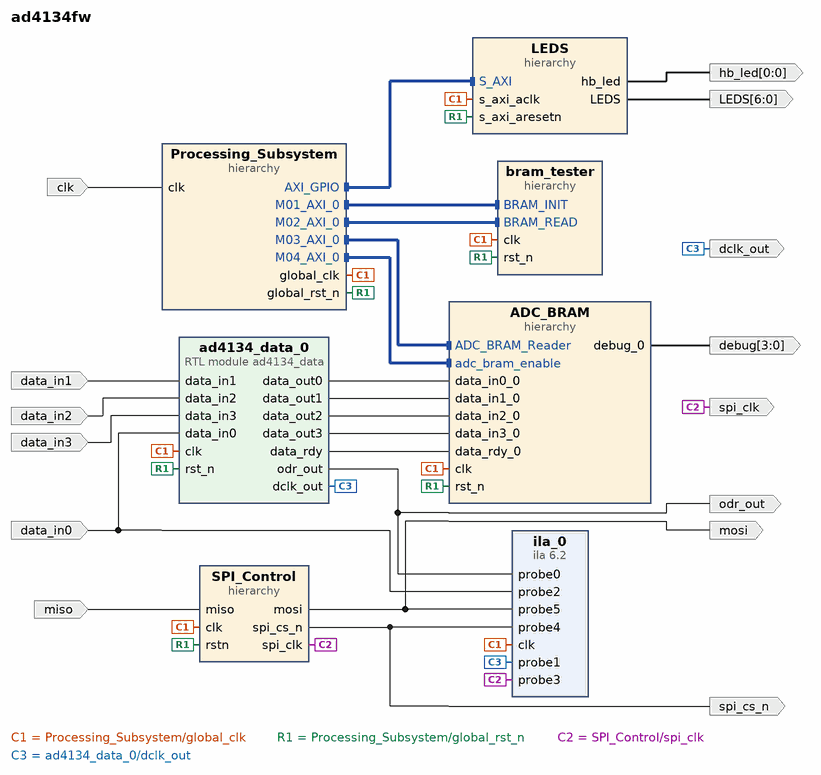
[diagram p0: block diagram of the top level]
# Vivado block design ad4134fw, xck26-sfvc784-2LV-c, Vivado 2024.2
create_bd_design ad4134fw

create_bd_port -dir O spi_clk
create_bd_port -dir I miso
create_bd_port -dir O mosi
create_bd_port -dir O spi_cs_n
create_bd_port -dir O -from 3 -to 0 debug
create_bd_port -dir O -from 6 -to 0 LEDS
create_bd_port -dir O -from 0 -to 0 hb_led
create_bd_port -dir O dclk_out
create_bd_port -dir O odr_out
create_bd_port -dir I data_in0
create_bd_port -dir I data_in1
create_bd_port -dir I data_in2
create_bd_port -dir I data_in3
create_bd_port -dir I -type clk clk
set_property -dict {CONFIG.FREQ_HZ 25000000} [get_bd_ports clk]

create_bd_cell -type hier Processing_Subsystem
create_bd_cell -type hier SPI_Control
create_bd_cell -type hier LEDS
create_bd_cell -type module -reference ad4134_data ad4134_data_0
create_bd_cell -type hier bram_tester
create_bd_cell -type hier ADC_BRAM
create_bd_cell -type ip -vlnv xilinx.com:ip:ila:6.2 ila_0
set_property -dict [list \
  CONFIG.C_ADV_TRIGGER true \
  CONFIG.C_DATA_DEPTH 131072 \
  CONFIG.C_EN_STRG_QUAL 1 \
  CONFIG.C_MONITOR_TYPE Native \
  CONFIG.C_NUM_OF_PROBES 6 \
] [get_bd_cells ila_0]

# ---- hierarchy /Processing_Subsystem ----
current_bd_instance /Processing_Subsystem
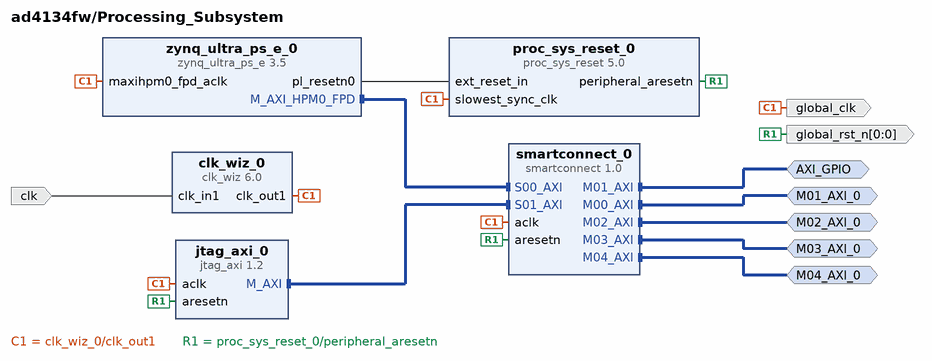
[diagram p1: block diagram inside /Processing_Subsystem]
create_bd_intf_pin -mode Master -vlnv xilinx.com:interface:aximm_rtl:1.0 AXI_GPIO
create_bd_intf_pin -mode Master -vlnv xilinx.com:interface:aximm_rtl:1.0 M01_AXI_0
create_bd_intf_pin -mode Master -vlnv xilinx.com:interface:aximm_rtl:1.0 M02_AXI_0
create_bd_intf_pin -mode Master -vlnv xilinx.com:interface:aximm_rtl:1.0 M03_AXI_0
create_bd_intf_pin -mode Master -vlnv xilinx.com:interface:aximm_rtl:1.0 M04_AXI_0
create_bd_pin -dir O -from 0 -to 0 global_rst_n
create_bd_pin -dir O global_clk
create_bd_pin -dir I clk

create_bd_cell -type ip -vlnv xilinx.com:ip:proc_sys_reset:5.0 proc_sys_reset_0
create_bd_cell -type ip -vlnv xilinx.com:ip:clk_wiz:6.0 clk_wiz_0
set_property -dict [list \
  CONFIG.CLKIN1_JITTER_PS 400.0 \
  CONFIG.CLKOUT1_DRIVES BUFG \
  CONFIG.CLKOUT1_JITTER 207.962 \
  CONFIG.CLKOUT1_PHASE_ERROR 222.305 \
  CONFIG.CLKOUT1_REQUESTED_OUT_FREQ 50.000 \
  CONFIG.CLKOUT2_DRIVES Buffer \
  CONFIG.CLKOUT2_JITTER 285.743 \
  CONFIG.CLKOUT2_PHASE_ERROR 164.985 \
  CONFIG.CLKOUT2_REQUESTED_OUT_FREQ 100.000 \
  CONFIG.CLKOUT2_USED false \
  CONFIG.CLKOUT3_DRIVES Buffer \
  CONFIG.CLKOUT4_DRIVES Buffer \
  CONFIG.CLKOUT5_DRIVES Buffer \
  CONFIG.CLKOUT6_DRIVES Buffer \
  CONFIG.CLKOUT7_DRIVES Buffer \
  CONFIG.CLK_OUT2_PORT clk_out2 \
  CONFIG.MMCM_CLKFBOUT_MULT_F 48.000 \
  CONFIG.MMCM_CLKIN1_PERIOD 40.000 \
  CONFIG.MMCM_CLKIN2_PERIOD 10.0 \
  CONFIG.MMCM_CLKOUT0_DIVIDE_F 24.000 \
  CONFIG.MMCM_CLKOUT1_DIVIDE 1 \
  CONFIG.MMCM_COMPENSATION AUTO \
  CONFIG.NUM_OUT_CLKS 1 \
  CONFIG.PHASESHIFT_MODE WAVEFORM \
  CONFIG.USE_LOCKED false \
  CONFIG.USE_PHASE_ALIGNMENT true \
  CONFIG.USE_RESET false \
] [get_bd_cells clk_wiz_0]
create_bd_cell -type ip -vlnv xilinx.com:ip:zynq_ultra_ps_e:3.5 zynq_ultra_ps_e_0
set_property -dict [list \
  CONFIG.PSU__DDR_HIGH_ADDRESS_GUI_ENABLE 0 \
  CONFIG.PSU__MAXIGP0__DATA_WIDTH 128 \
  CONFIG.PSU__USE__M_AXI_GP0 1 \
  CONFIG.PSU__USE__M_AXI_GP2 0 \
] [get_bd_cells zynq_ultra_ps_e_0]
# 2 more settings of zynq_ultra_ps_e_0 are not shown: defaults, MIO pin electricals, DDR timing, and values the tool derives
create_bd_cell -type ip -vlnv xilinx.com:ip:smartconnect:1.0 smartconnect_0
set_property -dict {CONFIG.NUM_MI 5 CONFIG.NUM_SI 2} [get_bd_cells smartconnect_0]
create_bd_cell -type ip -vlnv xilinx.com:ip:jtag_axi:1.2 jtag_axi_0

# ---- hierarchy /SPI_Control ----
current_bd_instance /SPI_Control
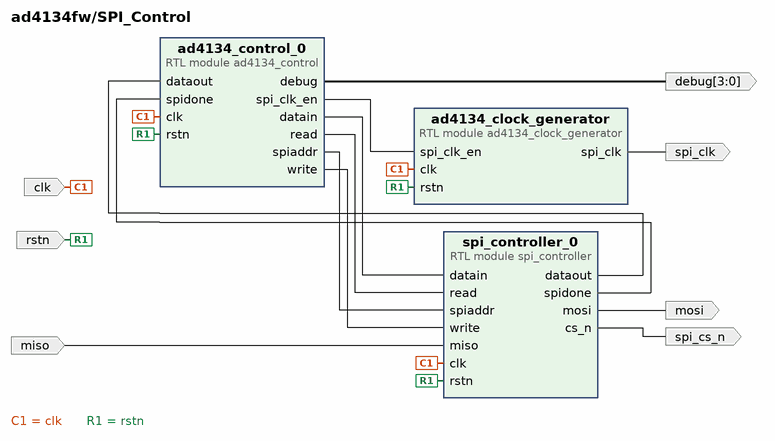
[diagram p2: block diagram inside /SPI_Control]
create_bd_pin -dir I -type clk clk
create_bd_pin -dir I -type rst rstn
create_bd_pin -dir O -type clk spi_clk
create_bd_pin -dir O -from 3 -to 0 debug
create_bd_pin -dir O mosi
create_bd_pin -dir I miso
create_bd_pin -dir O spi_cs_n

create_bd_cell -type module -reference ad4134_clock_generator ad4134_clock_generator
create_bd_cell -type module -reference ad4134_control ad4134_control_0
create_bd_cell -type module -reference spi_controller spi_controller_0

# ---- hierarchy /LEDS ----
current_bd_instance /LEDS
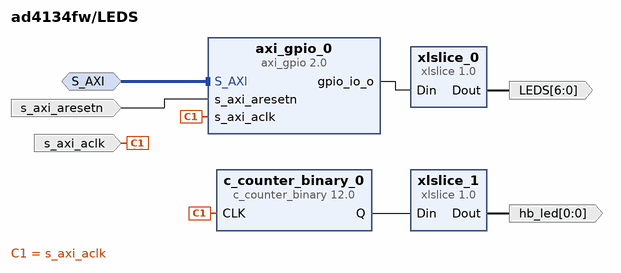
[diagram p3: block diagram inside /LEDS]
create_bd_intf_pin -mode Slave -vlnv xilinx.com:interface:aximm_rtl:1.0 S_AXI
create_bd_pin -dir O -from 6 -to 0 LEDS
create_bd_pin -dir O -from 0 -to 0 hb_led
create_bd_pin -dir I -type clk s_axi_aclk
create_bd_pin -dir I -type rst s_axi_aresetn

create_bd_cell -type ip -vlnv xilinx.com:ip:xlslice:1.0 xlslice_0
set_property -dict {CONFIG.DIN_FROM 6 CONFIG.DOUT_WIDTH 7} [get_bd_cells xlslice_0]
create_bd_cell -type ip -vlnv xilinx.com:ip:xlslice:1.0 xlslice_1
set_property -dict {CONFIG.DIN_FROM 25 CONFIG.DIN_TO 25} [get_bd_cells xlslice_1]
create_bd_cell -type ip -vlnv xilinx.com:ip:c_counter_binary:12.0 c_counter_binary_0
set_property -dict {CONFIG.Increment_Value 1 CONFIG.Output_Width 32} [get_bd_cells c_counter_binary_0]
create_bd_cell -type ip -vlnv xilinx.com:ip:axi_gpio:2.0 axi_gpio_0
set_property -dict {CONFIG.C_ALL_OUTPUTS 1} [get_bd_cells axi_gpio_0]

# ---- hierarchy /bram_tester ----
current_bd_instance /bram_tester
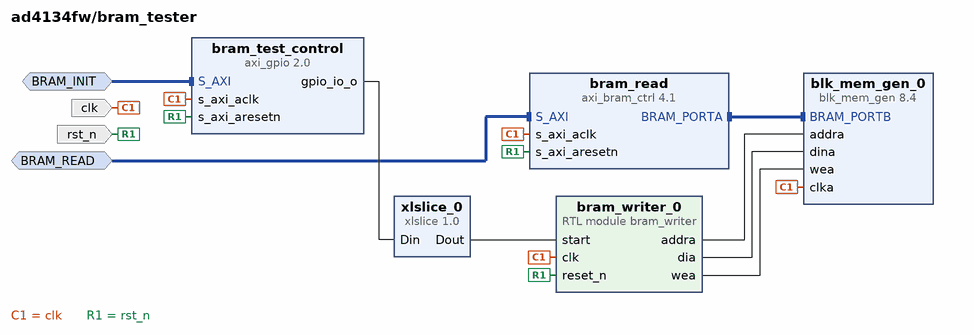
[diagram p4: block diagram inside /bram_tester]
create_bd_intf_pin -mode Slave -vlnv xilinx.com:interface:aximm_rtl:1.0 BRAM_INIT
create_bd_intf_pin -mode Slave -vlnv xilinx.com:interface:aximm_rtl:1.0 BRAM_READ
create_bd_pin -dir I clk
create_bd_pin -dir I rst_n

create_bd_cell -type module -reference bram_writer bram_writer_0
create_bd_cell -type ip -vlnv xilinx.com:ip:blk_mem_gen:8.4 blk_mem_gen_0
set_property -dict [list \
  CONFIG.Enable_32bit_Address false \
  CONFIG.Enable_A Always_Enabled \
  CONFIG.Enable_B Always_Enabled \
  CONFIG.Memory_Type Simple_Dual_Port_RAM \
  CONFIG.Operating_Mode_A NO_CHANGE \
  CONFIG.Port_B_Clock 100 \
  CONFIG.Port_B_Enable_Rate 100 \
  CONFIG.Register_PortB_Output_of_Memory_Primitives true \
  CONFIG.Use_Byte_Write_Enable false \
  CONFIG.use_bram_block Stand_Alone \
] [get_bd_cells blk_mem_gen_0]
create_bd_cell -type ip -vlnv xilinx.com:ip:axi_bram_ctrl:4.1 bram_read
set_property -dict {CONFIG.SINGLE_PORT_BRAM 1} [get_bd_cells bram_read]
create_bd_cell -type ip -vlnv xilinx.com:ip:axi_gpio:2.0 bram_test_control
set_property -dict {CONFIG.C_ALL_OUTPUTS 1} [get_bd_cells bram_test_control]
create_bd_cell -type ip -vlnv xilinx.com:ip:xlslice:1.0 xlslice_0

# ---- hierarchy /ADC_BRAM ----
current_bd_instance /ADC_BRAM
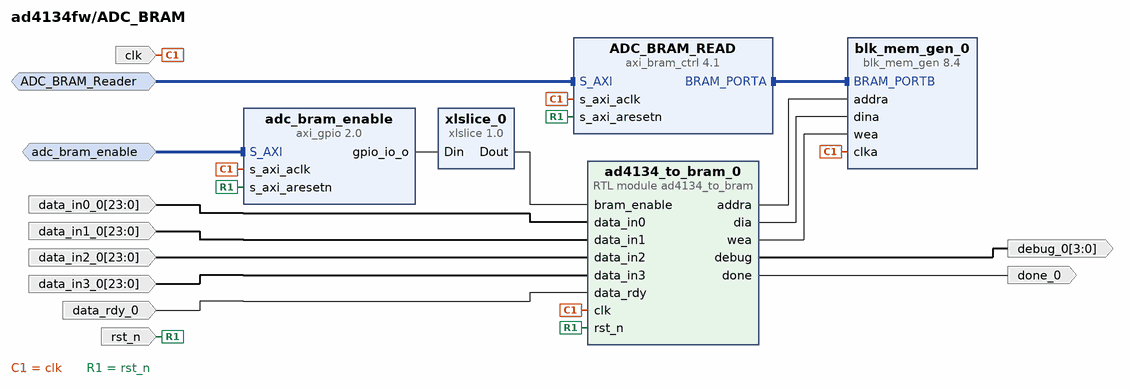
[diagram p5: block diagram inside /ADC_BRAM]
create_bd_intf_pin -mode Slave -vlnv xilinx.com:interface:aximm_rtl:1.0 ADC_BRAM_Reader
create_bd_intf_pin -mode Slave -vlnv xilinx.com:interface:aximm_rtl:1.0 adc_bram_enable
create_bd_pin -dir I clk
create_bd_pin -dir I rst_n
create_bd_pin -dir I -from 23 -to 0 data_in0_0
create_bd_pin -dir I -from 23 -to 0 data_in1_0
create_bd_pin -dir I -from 23 -to 0 data_in2_0
create_bd_pin -dir I -from 23 -to 0 data_in3_0
create_bd_pin -dir I data_rdy_0
create_bd_pin -dir O done_0
create_bd_pin -dir O -from 3 -to 0 debug_0

create_bd_cell -type ip -vlnv xilinx.com:ip:blk_mem_gen:8.4 blk_mem_gen_0
set_property -dict [list \
  CONFIG.Enable_32bit_Address false \
  CONFIG.Enable_A Always_Enabled \
  CONFIG.Enable_B Always_Enabled \
  CONFIG.Memory_Type Simple_Dual_Port_RAM \
  CONFIG.Operating_Mode_A NO_CHANGE \
  CONFIG.Port_B_Clock 100 \
  CONFIG.Port_B_Enable_Rate 100 \
  CONFIG.Register_PortB_Output_of_Memory_Primitives true \
  CONFIG.Use_Byte_Write_Enable false \
  CONFIG.Write_Depth_A 32768 \
  CONFIG.use_bram_block Stand_Alone \
] [get_bd_cells blk_mem_gen_0]
create_bd_cell -type ip -vlnv xilinx.com:ip:axi_bram_ctrl:4.1 ADC_BRAM_READ
set_property -dict {CONFIG.SINGLE_PORT_BRAM 1} [get_bd_cells ADC_BRAM_READ]
create_bd_cell -type module -reference ad4134_to_bram ad4134_to_bram_0
create_bd_cell -type ip -vlnv xilinx.com:ip:axi_gpio:2.0 adc_bram_enable
set_property -dict {CONFIG.C_ALL_OUTPUTS 1} [get_bd_cells adc_bram_enable]
create_bd_cell -type ip -vlnv xilinx.com:ip:xlslice:1.0 xlslice_0

# ---- connections ----

current_bd_instance /Processing_Subsystem
connect_bd_intf_net [get_bd_intf_pins jtag_axi_0/M_AXI] [get_bd_intf_pins smartconnect_0/S01_AXI]
connect_bd_intf_net [get_bd_intf_pins M01_AXI_0] [get_bd_intf_pins smartconnect_0/M00_AXI]
connect_bd_intf_net [get_bd_intf_pins AXI_GPIO] [get_bd_intf_pins smartconnect_0/M01_AXI]
connect_bd_intf_net [get_bd_intf_pins M02_AXI_0] [get_bd_intf_pins smartconnect_0/M02_AXI]
connect_bd_intf_net [get_bd_intf_pins M03_AXI_0] [get_bd_intf_pins smartconnect_0/M03_AXI]
connect_bd_intf_net [get_bd_intf_pins M04_AXI_0] [get_bd_intf_pins smartconnect_0/M04_AXI]
connect_bd_intf_net [get_bd_intf_pins zynq_ultra_ps_e_0/M_AXI_HPM0_FPD] [get_bd_intf_pins smartconnect_0/S00_AXI]
connect_bd_net [get_bd_pins clk_wiz_0/clk_out1] \
  [get_bd_pins global_clk] [get_bd_pins smartconnect_0/aclk] [get_bd_pins zynq_ultra_ps_e_0/maxihpm0_fpd_aclk] \
  [get_bd_pins proc_sys_reset_0/slowest_sync_clk] [get_bd_pins jtag_axi_0/aclk]
connect_bd_net [get_bd_pins proc_sys_reset_0/peripheral_aresetn] \
  [get_bd_pins global_rst_n] [get_bd_pins smartconnect_0/aresetn] [get_bd_pins jtag_axi_0/aresetn]
connect_bd_net -net processing_system7_0_FCLK_CLK0 [get_bd_pins clk] [get_bd_pins clk_wiz_0/clk_in1]
connect_bd_net [get_bd_pins zynq_ultra_ps_e_0/pl_resetn0] [get_bd_pins proc_sys_reset_0/ext_reset_in]

current_bd_instance /SPI_Control
connect_bd_net -net Processing_Subsystem_global_clk [get_bd_pins clk] \
  [get_bd_pins ad4134_clock_generator/clk] [get_bd_pins ad4134_control_0/clk] [get_bd_pins spi_controller_0/clk]
connect_bd_net -net Processing_Subsystem_global_rst_n [get_bd_pins rstn] \
  [get_bd_pins ad4134_clock_generator/rstn] [get_bd_pins ad4134_control_0/rstn] [get_bd_pins spi_controller_0/rstn]
connect_bd_net -net ad4134_clock_generat_0_spi_clk [get_bd_pins ad4134_clock_generator/spi_clk] [get_bd_pins spi_clk]
connect_bd_net [get_bd_pins ad4134_control_0/datain] [get_bd_pins spi_controller_0/datain]
connect_bd_net [get_bd_pins ad4134_control_0/debug] [get_bd_pins debug]
connect_bd_net [get_bd_pins ad4134_control_0/read] [get_bd_pins spi_controller_0/read]
connect_bd_net [get_bd_pins ad4134_control_0/spi_clk_en] [get_bd_pins ad4134_clock_generator/spi_clk_en]
connect_bd_net [get_bd_pins ad4134_control_0/spiaddr] [get_bd_pins spi_controller_0/spiaddr]
connect_bd_net [get_bd_pins ad4134_control_0/write] [get_bd_pins spi_controller_0/write]
connect_bd_net [get_bd_pins miso] [get_bd_pins spi_controller_0/miso]
connect_bd_net [get_bd_pins spi_controller_0/cs_n] [get_bd_pins spi_cs_n]
connect_bd_net [get_bd_pins spi_controller_0/dataout] [get_bd_pins ad4134_control_0/dataout]
connect_bd_net [get_bd_pins spi_controller_0/mosi] [get_bd_pins mosi]
connect_bd_net [get_bd_pins spi_controller_0/spidone] [get_bd_pins ad4134_control_0/spidone]

current_bd_instance /LEDS
connect_bd_intf_net -intf_net Processing_Subsystem_AXI_GPIO [get_bd_intf_pins S_AXI] [get_bd_intf_pins axi_gpio_0/S_AXI]
connect_bd_net -net Processing_Subsystem_global_clk [get_bd_pins s_axi_aclk] [get_bd_pins axi_gpio_0/s_axi_aclk] [get_bd_pins c_counter_binary_0/CLK]
connect_bd_net -net Processing_Subsystem_global_rst_n [get_bd_pins s_axi_aresetn] [get_bd_pins axi_gpio_0/s_axi_aresetn]
connect_bd_net [get_bd_pins axi_gpio_0/gpio_io_o] [get_bd_pins xlslice_0/Din]
connect_bd_net [get_bd_pins c_counter_binary_0/Q] [get_bd_pins xlslice_1/Din]
connect_bd_net [get_bd_pins xlslice_0/Dout] [get_bd_pins LEDS]
connect_bd_net [get_bd_pins xlslice_1/Dout] [get_bd_pins hb_led]

current_bd_instance /bram_tester
connect_bd_intf_net [get_bd_intf_pins bram_test_control/S_AXI] [get_bd_intf_pins BRAM_INIT]
connect_bd_intf_net [get_bd_intf_pins bram_read/S_AXI] [get_bd_intf_pins BRAM_READ]
connect_bd_intf_net -intf_net axi_bram_ctrl_0_BRAM_PORTA [get_bd_intf_pins bram_read/BRAM_PORTA] [get_bd_intf_pins blk_mem_gen_0/BRAM_PORTB]
connect_bd_net [get_bd_pins bram_test_control/gpio_io_o] [get_bd_pins xlslice_0/Din]
connect_bd_net [get_bd_pins bram_writer_0/addra] [get_bd_pins blk_mem_gen_0/addra]
connect_bd_net [get_bd_pins bram_writer_0/dia] [get_bd_pins blk_mem_gen_0/dina]
connect_bd_net [get_bd_pins bram_writer_0/wea] [get_bd_pins blk_mem_gen_0/wea]
connect_bd_net [get_bd_pins clk] \
  [get_bd_pins bram_read/s_axi_aclk] [get_bd_pins bram_test_control/s_axi_aclk] [get_bd_pins blk_mem_gen_0/clka] \
  [get_bd_pins bram_writer_0/clk]
connect_bd_net [get_bd_pins rst_n] \
  [get_bd_pins bram_read/s_axi_aresetn] [get_bd_pins bram_test_control/s_axi_aresetn] [get_bd_pins bram_writer_0/reset_n]
connect_bd_net [get_bd_pins xlslice_0/Dout] [get_bd_pins bram_writer_0/start]
set_property HDL_ATTRIBUTE.BMM_INFO_ADDRESS_SPACE {byte  0x40000000 32 > ad4134fw bram_tester/blk_mem_gen_0} [get_bd_cells bram_read]
set_property HDL_ATTRIBUTE.KEEP_HIERARCHY yes [get_bd_cells bram_read]

current_bd_instance /ADC_BRAM
connect_bd_intf_net [get_bd_intf_pins ADC_BRAM_READ/S_AXI] [get_bd_intf_pins ADC_BRAM_Reader]
connect_bd_intf_net [get_bd_intf_pins adc_bram_enable/S_AXI] [get_bd_intf_pins adc_bram_enable]
connect_bd_intf_net -intf_net axi_bram_ctrl_0_BRAM_PORTA [get_bd_intf_pins ADC_BRAM_READ/BRAM_PORTA] [get_bd_intf_pins blk_mem_gen_0/BRAM_PORTB]
connect_bd_net [get_bd_pins ad4134_to_bram_0/addra] [get_bd_pins blk_mem_gen_0/addra]
connect_bd_net [get_bd_pins ad4134_to_bram_0/debug] [get_bd_pins debug_0]
connect_bd_net [get_bd_pins ad4134_to_bram_0/dia] [get_bd_pins blk_mem_gen_0/dina]
connect_bd_net [get_bd_pins ad4134_to_bram_0/done] [get_bd_pins done_0]
connect_bd_net [get_bd_pins ad4134_to_bram_0/wea] [get_bd_pins blk_mem_gen_0/wea]
connect_bd_net [get_bd_pins adc_bram_enable/gpio_io_o] [get_bd_pins xlslice_0/Din]
connect_bd_net [get_bd_pins clk] \
  [get_bd_pins ADC_BRAM_READ/s_axi_aclk] [get_bd_pins adc_bram_enable/s_axi_aclk] [get_bd_pins blk_mem_gen_0/clka] \
  [get_bd_pins ad4134_to_bram_0/clk]
connect_bd_net -net data_in0_0_1 [get_bd_pins data_in0_0] [get_bd_pins ad4134_to_bram_0/data_in0]
connect_bd_net -net data_in1_0_1 [get_bd_pins data_in1_0] [get_bd_pins ad4134_to_bram_0/data_in1]
connect_bd_net -net data_in2_0_1 [get_bd_pins data_in2_0] [get_bd_pins ad4134_to_bram_0/data_in2]
connect_bd_net -net data_in3_0_1 [get_bd_pins data_in3_0] [get_bd_pins ad4134_to_bram_0/data_in3]
connect_bd_net -net data_rdy_0_1 [get_bd_pins data_rdy_0] [get_bd_pins ad4134_to_bram_0/data_rdy]
connect_bd_net [get_bd_pins rst_n] \
  [get_bd_pins ADC_BRAM_READ/s_axi_aresetn] [get_bd_pins adc_bram_enable/s_axi_aresetn] [get_bd_pins ad4134_to_bram_0/rst_n]
connect_bd_net [get_bd_pins xlslice_0/Dout] [get_bd_pins ad4134_to_bram_0/bram_enable]
set_property HDL_ATTRIBUTE.BMM_INFO_ADDRESS_SPACE {byte  0x42000000 32 > ad4134fw ADC_BRAM/blk_mem_gen_0} [get_bd_cells ADC_BRAM_READ]
set_property HDL_ATTRIBUTE.KEEP_HIERARCHY yes [get_bd_cells ADC_BRAM_READ]

current_bd_instance /
connect_bd_intf_net [get_bd_intf_pins LEDS/S_AXI] [get_bd_intf_pins Processing_Subsystem/AXI_GPIO]
connect_bd_intf_net [get_bd_intf_pins Processing_Subsystem/M01_AXI_0] [get_bd_intf_pins bram_tester/BRAM_INIT]
connect_bd_intf_net [get_bd_intf_pins Processing_Subsystem/M02_AXI_0] [get_bd_intf_pins bram_tester/BRAM_READ]
connect_bd_intf_net [get_bd_intf_pins Processing_Subsystem/M03_AXI_0] [get_bd_intf_pins ADC_BRAM/ADC_BRAM_Reader]
connect_bd_intf_net [get_bd_intf_pins Processing_Subsystem/M04_AXI_0] [get_bd_intf_pins ADC_BRAM/adc_bram_enable]
connect_bd_net [get_bd_pins ADC_BRAM/debug_0] [get_bd_ports debug]
connect_bd_net [get_bd_pins Processing_Subsystem/global_clk] \
  [get_bd_pins SPI_Control/clk] [get_bd_pins LEDS/s_axi_aclk] [get_bd_pins bram_tester/clk] [get_bd_pins ADC_BRAM/clk] \
  [get_bd_pins ad4134_data_0/clk] [get_bd_pins ila_0/clk]
connect_bd_net [get_bd_pins Processing_Subsystem/global_rst_n] \
  [get_bd_pins SPI_Control/rstn] [get_bd_pins LEDS/s_axi_aresetn] [get_bd_pins bram_tester/rst_n] \
  [get_bd_pins ADC_BRAM/rst_n] [get_bd_pins ad4134_data_0/rst_n]
connect_bd_net -net ad4134_clock_generat_0_spi_clk [get_bd_pins SPI_Control/spi_clk] [get_bd_ports spi_clk] [get_bd_pins ila_0/probe3]
connect_bd_net [get_bd_pins ad4134_data_0/data_out0] [get_bd_pins ADC_BRAM/data_in0_0]
connect_bd_net [get_bd_pins ad4134_data_0/data_out1] [get_bd_pins ADC_BRAM/data_in1_0]
connect_bd_net [get_bd_pins ad4134_data_0/data_out2] [get_bd_pins ADC_BRAM/data_in2_0]
connect_bd_net [get_bd_pins ad4134_data_0/data_out3] [get_bd_pins ADC_BRAM/data_in3_0]
connect_bd_net [get_bd_pins ad4134_data_0/data_rdy] [get_bd_pins ADC_BRAM/data_rdy_0]
connect_bd_net [get_bd_pins ad4134_data_0/dclk_out] [get_bd_ports dclk_out] [get_bd_pins ila_0/probe1]
connect_bd_net [get_bd_pins ad4134_data_0/odr_out] [get_bd_ports odr_out] [get_bd_pins ila_0/probe0]
connect_bd_net [get_bd_ports clk] [get_bd_pins Processing_Subsystem/clk]
connect_bd_net -net data_in0_1 [get_bd_ports data_in0] [get_bd_pins ad4134_data_0/data_in0] [get_bd_pins ila_0/probe2]
connect_bd_net -net data_in1_1 [get_bd_ports data_in1] [get_bd_pins ad4134_data_0/data_in1]
connect_bd_net -net data_in2_1 [get_bd_ports data_in2] [get_bd_pins ad4134_data_0/data_in2]
connect_bd_net -net data_in3_1 [get_bd_ports data_in3] [get_bd_pins ad4134_data_0/data_in3]
connect_bd_net [get_bd_ports miso] [get_bd_pins SPI_Control/miso]
connect_bd_net -net spi_controller_0_cs_n [get_bd_pins SPI_Control/spi_cs_n] [get_bd_ports spi_cs_n] [get_bd_pins ila_0/probe4]
connect_bd_net -net spi_controller_0_mosi [get_bd_pins SPI_Control/mosi] [get_bd_ports mosi] [get_bd_pins ila_0/probe5]
connect_bd_net -net xlslice_0_Dout [get_bd_pins LEDS/LEDS] [get_bd_ports LEDS]
connect_bd_net -net xlslice_1_Dout [get_bd_pins LEDS/hb_led] [get_bd_ports hb_led]

# ---- address map ----
assign_bd_address -offset 0xA0000000 -range 8K -target_address_space [get_bd_addr_spaces Processing_Subsystem/jtag_axi_0/Data] [get_bd_addr_segs ADC_BRAM/ADC_BRAM_READ/S_AXI/Mem0]
assign_bd_address -offset 0xA0002000 -range 8K -target_address_space [get_bd_addr_spaces Processing_Subsystem/jtag_axi_0/Data] [get_bd_addr_segs bram_tester/bram_read/S_AXI/Mem0]
assign_bd_address -offset 0xA0010000 -range 64K -target_address_space [get_bd_addr_spaces Processing_Subsystem/jtag_axi_0/Data] [get_bd_addr_segs ADC_BRAM/adc_bram_enable/S_AXI/Reg]
assign_bd_address -offset 0xA0020000 -range 64K -target_address_space [get_bd_addr_spaces Processing_Subsystem/jtag_axi_0/Data] [get_bd_addr_segs LEDS/axi_gpio_0/S_AXI/Reg]
assign_bd_address -offset 0xA0030000 -range 64K -target_address_space [get_bd_addr_spaces Processing_Subsystem/jtag_axi_0/Data] [get_bd_addr_segs bram_tester/bram_test_control/S_AXI/Reg]
assign_bd_address -offset 0x00A0000000 -range 8K -target_address_space [get_bd_addr_spaces Processing_Subsystem/zynq_ultra_ps_e_0/Data] [get_bd_addr_segs ADC_BRAM/ADC_BRAM_READ/S_AXI/Mem0]
assign_bd_address -offset 0x00A0002000 -range 8K -target_address_space [get_bd_addr_spaces Processing_Subsystem/zynq_ultra_ps_e_0/Data] [get_bd_addr_segs bram_tester/bram_read/S_AXI/Mem0]
assign_bd_address -offset 0x00A0010000 -range 64K -target_address_space [get_bd_addr_spaces Processing_Subsystem/zynq_ultra_ps_e_0/Data] [get_bd_addr_segs ADC_BRAM/adc_bram_enable/S_AXI/Reg]
assign_bd_address -offset 0x00A0020000 -range 64K -target_address_space [get_bd_addr_spaces Processing_Subsystem/zynq_ultra_ps_e_0/Data] [get_bd_addr_segs LEDS/axi_gpio_0/S_AXI/Reg]
assign_bd_address -offset 0x00A0030000 -range 64K -target_address_space [get_bd_addr_spaces Processing_Subsystem/zynq_ultra_ps_e_0/Data] [get_bd_addr_segs bram_tester/bram_test_control/S_AXI/Reg]

validate_bd_design
save_bd_design
